# EAGLE design LACE_motherboard (EAGLE 5.09)
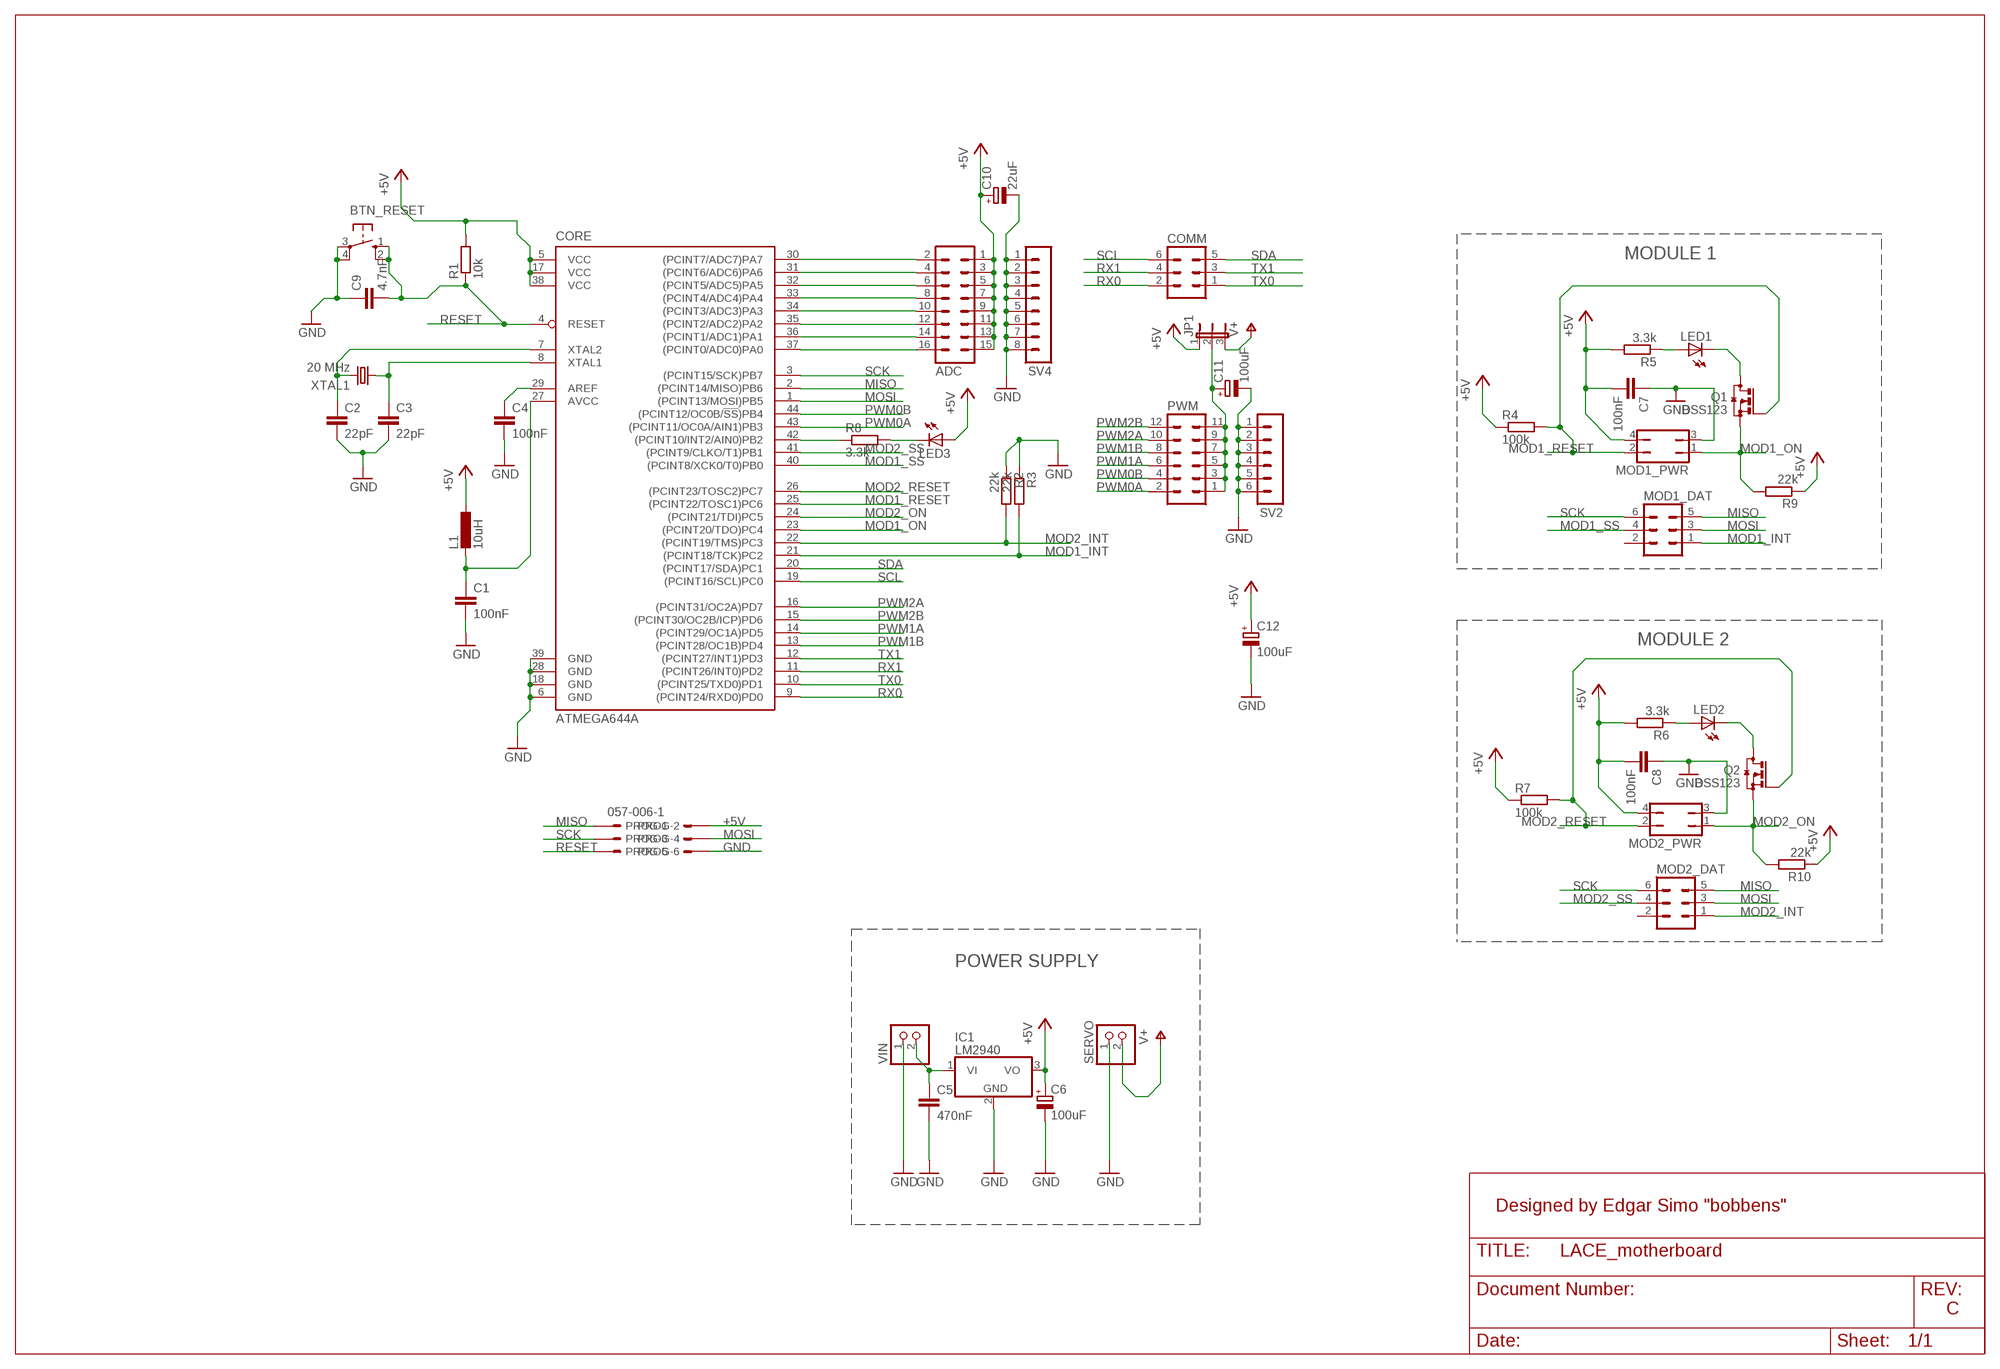
[diagram p0: schematic, sheet 1]

## Parts
ADC  MA08-2  [MA08-2]
BTN_RESET  10-XX  [B3F-10XX]
C1  100nF  C-EUC0805K  [C0805K]
C2  22pF  C-EUC0805K  [C0805K]
C3  22pF  C-EUC0805K  [C0805K]
C4  100nF  C-EUC0805K  [C0805K]
C5  470nF  C-EUC0805K  [C0805K]
C6  100uF  CPOL-EUE5-4  [E5-4]
C7  100nF  C-EUC0805K  [C0805K]
C8  100nF  C-EUC0805K  [C0805K]
C9  4.7nF  C-EUC0805K  [C0805K]
C10  22uF  CPOL-EUE5-4  [E5-4]
C11  100uF  CPOL-EUE5-4  [E5-4]
C12  100uF  CPOL-EUE5-4  [E5-4]
COMM  MA03-2  [MA03-2]
CORE  ATMEGA644A  [TQFP44]
IC1  LM2940  7815T  [TO220H]
JP1  JP2E  [JP2]
L1  10uH  L-EUL0805  [L0805]
LED1  LEDCHIPLED_0805  [CHIPLED_0805]
LED2  LEDCHIPLED_0805  [CHIPLED_0805]
LED3  LEDCHIPLED_0805  [CHIPLED_0805]
MOD1_DAT  MA03-2  [MA03-2]
MOD1_PWR  JP2Q  [JP2Q]
MOD2_DAT  MA03-2  [MA03-2]
MOD2_PWR  JP2Q  [JP2Q]
PROG  057-006-1  [057-006-1]
PWM  MA06-2  [MA06-2]
Q1  BSS123  [SOT23]
Q2  BSS123  [SOT23]
R1  10k  R-EU_M0805  [M0805]
R2  22k  R-EU_M0805  [M0805]
R3  22k  R-EU_M0805  [M0805]
R4  100k  R-EU_M0805  [M0805]
R5  3.3k  R-EU_M0805  [M0805]
R6  3.3k  R-EU_M0805  [M0805]
R7  100k  R-EU_M0805  [M0805]
R8  3.3k  R-EU_M0805  [M0805]
R9  22k  R-EU_M0805  [M0805]
R10  22k  R-EU_M0805  [M0805]
SERVO  PINHD-1X2  [1X02]
SV2  MA06-1  [MA06-1]
SV4  MA08-1  [MA08-1]
VIN  PINHD-1X2  [1X02]
XTAL1  20 MHz  CRYSTALHC49S  [HC49/S]

## Nets
+5V: ADC.1 ADC.3 ADC.5 ADC.7 ADC.9 ADC.11 ADC.13 ADC.15 C6.+ C7.2 C8.2 C10.+ C12.+ CORE.5(VCC) CORE.17(VCC) CORE.38(VCC) IC1.3(VO) JP1.1 L1.1 LED3.A MOD1_PWR.4 MOD2_PWR.4 PROG.2 R1.2 R4.1 R5.2 R6.2 R7.1 R9.1 R10.1
BAT+: C5.1 IC1.1(VI) VIN.2
GND: BTN_RESET.3(P) BTN_RESET.4(P1) C1.2 C2.2 C3.2 C4.2 C5.2 C6.- C7.1 C8.1 C9.1 C10.- C11.- C12.- CORE.6(GND) CORE.18(GND) CORE.28(GND) CORE.39(GND) IC1.2(GND) MOD1_PWR.3 MOD2_PWR.3 PROG.6 R2.1 R3.1 SERVO.1 SV2.1 SV2.2 SV2.3 SV2.4 SV2.5 SV2.6 SV4.1 SV4.2 SV4.3 SV4.4 SV4.5 SV4.6 SV4.7 SV4.8 VIN.1
MISO: CORE.2((PCINT14/MISO)PB6) MOD1_DAT.5 MOD2_DAT.5 PROG.1
MOD1_INT: CORE.21((PCINT18/TCK)PC2) MOD1_DAT.1 R3.2
MOD1_ON: CORE.23((PCINT20/TDO)PC4) MOD1_PWR.1 Q1.2(S) R9.2
MOD1_RESET: CORE.25((PCINT22/TOSC1)PC6) MOD1_PWR.2 Q1.1(G) R4.2
MOD1_SS: CORE.40((PCINT8/XCK0/T0)PB0) MOD1_DAT.4
MOD2_INT: CORE.22((PCINT19/TMS)PC3) MOD2_DAT.1 R2.2
MOD2_ON: CORE.24((PCINT21/TDI)PC5) MOD2_PWR.1 Q2.2(S) R10.2
MOD2_RESET: CORE.26((PCINT23/TOSC2)PC7) MOD2_PWR.2 Q2.1(G) R7.2
MOD2_SS: CORE.41((PCINT9/CLKO/T1)PB1) MOD2_DAT.4
MOSI: CORE.1((PCINT13/MOSI)PB5) MOD1_DAT.3 MOD2_DAT.3 PROG.4
N$1: CORE.42((PCINT10/INT2/AIN0)PB2) R8.1
N$2: C2.1 CORE.7(XTAL2) XTAL1.2
N$3: C11.+ JP1.2 PWM.1 PWM.3 PWM.5 PWM.7 PWM.9 PWM.11
N$4: C4.1 CORE.29(AREF)
N$5: ADC.16 CORE.37((PCINT0/ADC0)PA0)
N$6: ADC.14 CORE.36((PCINT1/ADC1)PA1)
N$7: ADC.12 CORE.35((PCINT2/ADC2)PA2)
N$8: ADC.10 CORE.34((PCINT3/ADC3)PA3)
N$9: ADC.8 CORE.33((PCINT4/ADC4)PA4)
N$10: ADC.6 CORE.32((PCINT5/ADC5)PA5)
N$11: ADC.4 CORE.31((PCINT6/ADC6)PA6)
N$12: ADC.2 CORE.30((PCINT7/ADC7)PA7)
N$13: LED2.C Q2.3(D)
N$14: LED3.C R8.2
N$15: C1.1 CORE.27(AVCC) L1.2
N$16: C3.1 CORE.8(XTAL1) XTAL1.1
N$17: LED1.C Q1.3(D)
PWM0A: CORE.43((PCINT11/OC0A/AIN1)PB3) PWM.2
PWM0B: CORE.44((PCINT12/OC0B/!SS!)PB4) PWM.4
PWM1A: CORE.14((PCINT29/OC1A)PD5) PWM.6
PWM1B: CORE.13((PCINT28/OC1B)PD4) PWM.8
PWM2A: CORE.16((PCINT31/OC2A)PD7) PWM.10
PWM2B: CORE.15((PCINT30/OC2B/ICP)PD6) PWM.12
R1: LED2.A R6.1
R5: LED1.A R5.1
RESET: BTN_RESET.1(S) BTN_RESET.2(S1) C9.2 CORE.4(RESET) PROG.5 R1.1
RX0: COMM.2 CORE.9((PCINT24/RXD0)PD0)
RX1: COMM.4 CORE.11((PCINT26/INT0)PD2)
SCK: CORE.3((PCINT15/SCK)PB7) MOD1_DAT.6 MOD2_DAT.6 PROG.3
SCL: COMM.6 CORE.19((PCINT16/SCL)PC0)
SDA: COMM.5 CORE.20((PCINT17/SDA)PC1)
TX0: COMM.1 CORE.10((PCINT25/TXD0)PD1)
TX1: COMM.3 CORE.12((PCINT27/INT1)PD3)
V+: JP1.3 SERVO.2
Unconnected: MOD1_DAT.2 MOD2_DAT.2

## Notes on the sheet
- MODULE 1
- MODULE 2
- POWER SUPPLY
- Designed by Edgar Simo "bobbens"
- C

## Library data of the parts
ADC = con-lstb:MA08-2: PIN HEADER
BTN_RESET = switch-omron:10-XX: OMRON SWITCH
C1-C5 C7-C9 = rcl:C-EU: CAPACITOR, European symbol
C6 C10-C12 = rcl:CPOL-EU: POLARIZED CAPACITOR, European symbol
COMM MOD1_DAT MOD2_DAT = con-lstb:MA03-2: PIN HEADER
CORE = atmel:ATMEGA644: 8-bit Microcontroller with 64K Bytes In-System Programmable Flash Source: http://www.atmel.com/dyn/resources/prod_documents/doc2593.pdf
IC1 = linear:78*: Positive VOLTAGE REGULATOR Source: http://cache.national.com/ds/LM/LM78L05.pdf http://www.fairchildsemi.com/ds/LM/LM7805.pdf
JP1 = jumper:JP2E: JUMPER
L1 = rcl:L-EU: INDUCTOR, European symbol
LED1-LED3 = led:LED: LED OSRAM: - CHIPLED LG R971, LG N971, LY N971, LG Q971, LY Q971, LO R971, LY R971 LH N974, LH R974 LS Q976, LO Q976, LY Q976 LO Q996 - Hyper CHIPLED LW Q18S LB Q993, LB Q99A, LB R99A - SideLED LS A670, LO A670, LY A670, LG A670, LP A670 LB A673, LV A673, LT A673, LW A673 LH A674 LY A675 LS A676, LA A676, LO A676, LY A676, LW A676 LS A679, LY A679, LG A679 - Hyper Micro SIDELED® LS Y876, LA Y876, LO Y876, LY Y876 LT Y87S - SmartLED LW L88C, LW L88S LB L89C, LB L89S, LG L890 LS L89K, LO L89K, LY L89K LS L896, LA L896, LO L896, LY L896 - TOPLED LS T670, LO T670, LY T670, LG T670, LP T670 LSG T670, LSP T670, LSY T670, LOP T670, LYG T670 LG T671, LOG T671, LSG T671 LB T673, LV T673, LT T673, LW T673 LH T674 LS T676, LA T676, LO T676, LY T676, LB T676, LH T676, LSB T676, LW T676 LB T67C, LV T67C, LT T67C, LS T67K, LO T67K, LY T67K, LW E67C LS E67B, LA E67B, LO E67B, LY E67B, LB E67C, LV E67C, LT E67C LW T67C LS T679, LY T679, LG T679 LS T770, LO T770, LY T770, LG T770, LP T770 LB T773, LV T773, LT T773, LW T773 LH T774 LS E675, LA E675, LY E675, LS T675 LS T776, LA T776, LO T776, LY T776, LB T776 LHGB T686 LT T68C, LB T68C - Hyper Mini TOPLED® LB M676 - Mini TOPLED Santana® LG M470 LS M47K, LO M47K, LY M47K Source: http://www.osram.convergy.de LUXEON: - LUMILED® LXK2-PW12-R00, LXK2-PW12-S00, LXK2-PW14-U00, LXK2-PW14-V00 LXK2-PM12-R00, LXK2-PM12-S00, LXK2-PM14-U00 LXK2-PE12-Q00, LXK2-PE12-R00, LXK2-PE12-S00, LXK2-PE14-T00, LXK2-PE14-U00 LXK2-PB12-K00, LXK2-PB12-L00, LXK2-PB12-M00, LXK2-PB14-N00, LXK2-PB14-P00, LXK2-PB14-Q00 LXK2-PR12-L00, LXK2-PR12-M00, LXK2-PR14-Q00, LXK2-PR14-R00 LXK2-PD12-Q00, LXK2-PD12-R00, LXK2-PD12-S00 LXK2-PH12-R00, LXK2-PH12-S00 LXK2-PL12-P00, LXK2-PL12-Q00, LXK2-PL12-R00 Source: www.luxeon.com KINGBRIGHT: KA-3528ASYC Source: www.kingbright.com
MOD1_PWR MOD2_PWR = jumper:JP2Q: JUMPER
PROG = con-panduit:057-006-: CONNECTOR 6-pin series 057 contact pc board low profile headers
PWM = con-lstb:MA06-2: PIN HEADER
Q1 Q2 = transistor-small-signal:BSS123: N-CHANNEL MOS FET
R1-R10 = rcl:R-EU_: RESISTOR, European symbol
SERVO VIN = pinhead:PINHD-1X2: PIN HEADER
SV2 = con-lstb:MA06-1: PIN HEADER
SV4 = con-lstb:MA08-1: PIN HEADER
XTAL1 = crystal:CRYSTAL: CRYSTAL

## Board
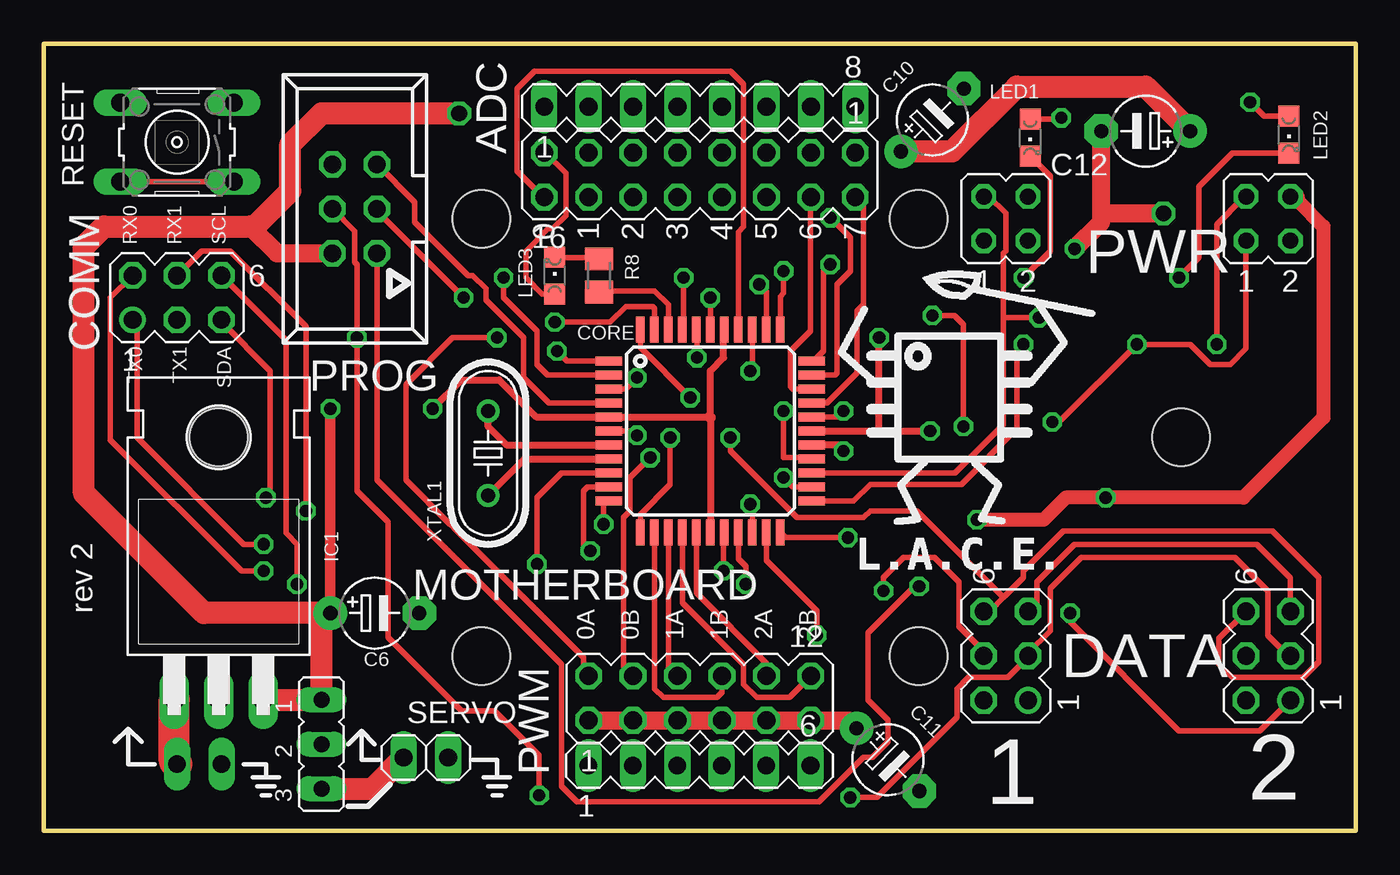
[diagram p1: board, top side]
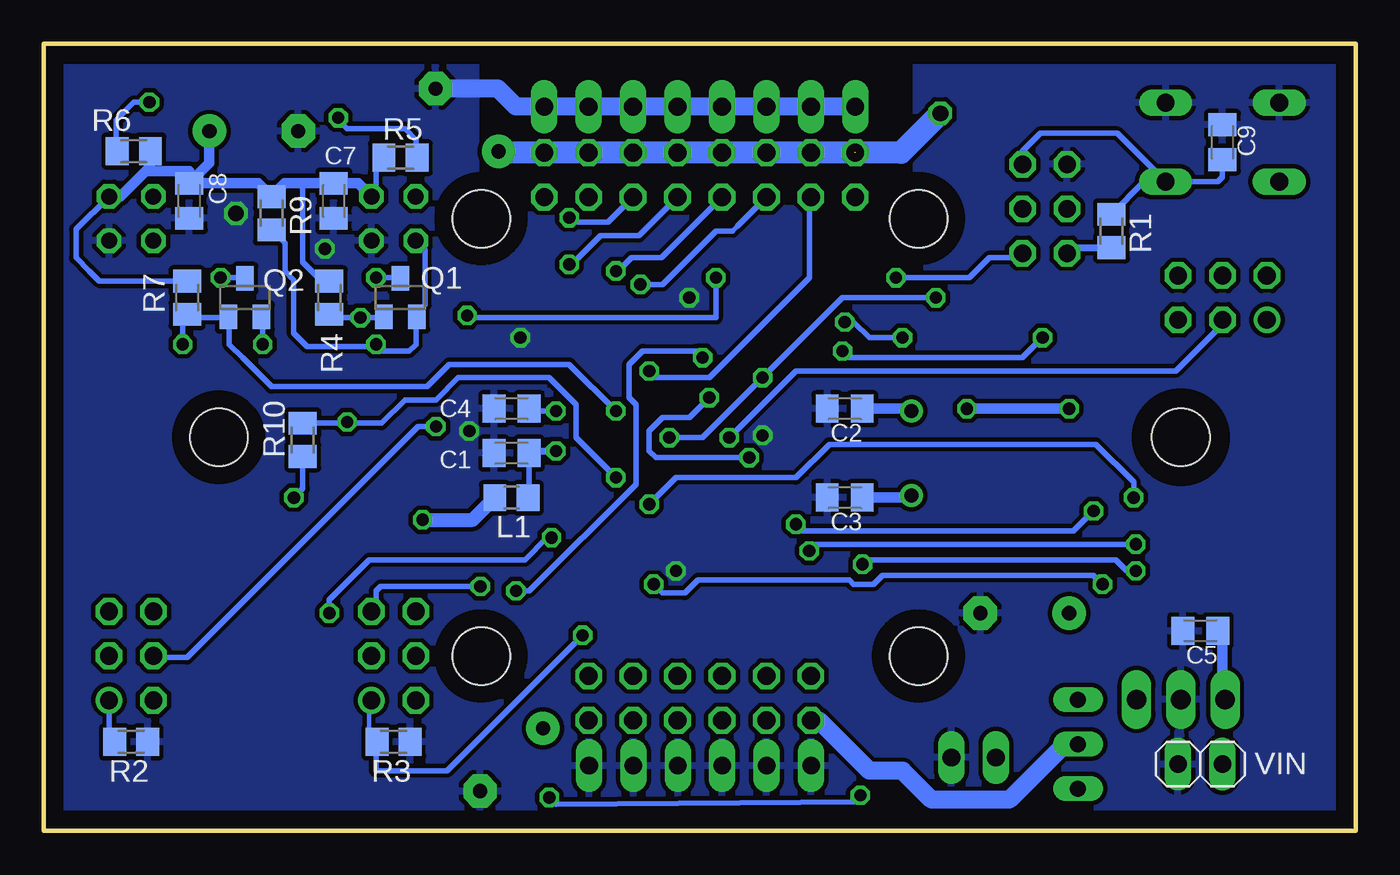
[diagram p2: board, bottom side, seen from below]

Size 75 x 45 mm. Coordinates in mm from the lower left corner, seen from the top.
Outline: 0,0 75,0 75,45 0,45 0,0
Copper layers (1*16): Top 0.035mm / dielectric 1.5mm / Bottom 0.035mm
Design rules "olimex-10mils *": minimum track width 10mil, minimum drill 0.7mm, track to track 10mil, track to pad 10mil, pad to pad 10mil, via to via 10mil, smd to smd 10mil, copper to edge 40mil, drill to drill 10mil, minimum pad ring 10mil, minimum via ring 8mil, stop-mask expansion 0mil, vias tented up to drill 0mil, thermal gap 10mil
Holes 3.3 mm at 25,35 50,35 50,10 25,10 65,22.5

### Footprints (pad centres in the part's own frame; a part is rotated, then mirrored left to right if it is on the bottom)
MA08-2 = drill 1.016 octagon: 1 -8.89,-1.27; 2 -8.89,1.27; 3 -6.35,-1.27; 4 -6.35,1.27; 5 -3.81,-1.27; 6 -3.81,1.27; 7 -1.27,-1.27; 8 -1.27,1.27; 9 1.27,-1.27; 10 1.27,1.27; 11 3.81,-1.27; 12 3.81,1.27; 13 6.35,-1.27; 14 6.35,1.27; 15 8.89,-1.27; 16 8.89,1.27
B3F-10XX = drill 1.016 long: 1 -3.251,2.261; 2 3.251,2.261; 3 -3.251,-2.261; 4 3.251,-2.261
C0805K = smd 1.3 x 1.6: 1 -1,0; 2 1,0
E5-4 = drill 0.813 pad 1.905 round: + -2.54,0 | drill 0.813 pad 1.905 octagon: - 2.54,0
MA03-2 = drill 1.016 round: 1 -2.54,-1.27 | drill 1.016 octagon: 2 -2.54,1.27; 3 0,-1.27; 4 0,1.27; 5 2.54,-1.27; 6 2.54,1.27
TQFP44 = smd 1.5 x 0.5: 1 -5.8,4; 2 -5.8,3.2; 3 -5.8,2.4; 4 -5.8,1.6; 5 -5.8,0.8; 6 -5.8,0; 7 -5.8,-0.8; 8 -5.8,-1.6; 9 -5.8,-2.4; 10 -5.8,-3.2; 11 -5.8,-4; 23 5.8,-4; 24 5.8,-3.2; 25 5.8,-2.4; 26 5.8,-1.6; 27 5.8,-0.8; 28 5.8,0; 29 5.8,0.8; 30 5.8,1.6; 31 5.8,2.4; 32 5.8,3.2; 33 5.8,4 | smd 0.5 x 1.5: 12 -4,-5.8; 13 -3.2,-5.8; 14 -2.4,-5.8; 15 -1.6,-5.8; 16 -0.8,-5.8; 17 0,-5.8; 18 0.8,-5.8; 19 1.6,-5.8; 20 2.4,-5.8; 21 3.2,-5.8; 22 4,-5.8; 34 4,5.8; 35 3.2,5.8; 36 2.4,5.8; 37 1.6,5.8; 38 0.8,5.8; 39 0,5.8; 40 -0.8,5.8; 41 -1.6,5.8; 42 -2.4,5.8; 43 -3.2,5.8; 44 -4,5.8
TO220H = drill 1.118 long: 1 -2.54,-10.16; 2 0,-10.16; 3 2.54,-10.16 | hole 3.302: 0,4.826
JP2 = drill 0.914 long: 1 -2.54,0; 2 0,0; 3 2.54,0
L0805 = smd 1.3 x 1.5: 1 -0.95,0; 2 0.95,0
CHIPLED_0805 = smd 1.2 x 1.2: A 0,-1.05; C 0,1.05
JP2Q = drill 0.914 octagon: 1 -1.27,-1.27; 2 -1.27,1.27; 3 1.27,-1.27; 4 1.27,1.27
057-006-1 = drill 1 octagon: 1 -2.54,-1.27; 2 -2.54,1.27; 3 0,-1.27; 4 0,1.27; 5 2.54,-1.27; 6 2.54,1.27
MA06-2 = drill 1.016 octagon: 1 -6.35,-1.27; 2 -6.35,1.27; 3 -3.81,-1.27; 4 -3.81,1.27; 5 -1.27,-1.27; 6 -1.27,1.27; 7 1.27,-1.27; 8 1.27,1.27; 9 3.81,-1.27; 10 3.81,1.27; 11 6.35,-1.27; 12 6.35,1.27
SOT23 = smd 1 x 1.4: 1 -0.95,-1.1; 2 0.95,-1.1; 3 0,1.1
M0805 = smd 1.3 x 1.6: 1 -0.95,0; 2 0.95,0
1X02 = drill 1.016 long: 1 -1.27,0; 2 1.27,0
MA06-1 = drill 1.016 long: 1 -6.35,0; 2 -3.81,0; 3 -1.27,0; 4 1.27,0; 5 3.81,0; 6 6.35,0
MA08-1 = drill 1.016 long: 1 -8.89,0; 2 -6.35,0; 3 -3.81,0; 4 -1.27,0; 5 1.27,0; 6 3.81,0; 7 6.35,0; 8 8.89,0
HC49/S = drill 0.813 round: 1 -2.413,0; 2 2.413,0

### Placement (x,y rotation side)
ADC  37.5,37.5 180 top
BTN_RESET  7.62,39.37 180 top
C1  48.26,21.59 180 bottom
C2  29.21,24.13 180 bottom
C3  29.21,19.05 180 bottom
C4  48.26,24.13 180 bottom
C5  8.89,11.43 180 bottom
C6  18.92,12.45 0 top
C7  58.42,36.02 90 bottom
C8  66.67,36.02 90 bottom
C9  7.62,39.37 270 bottom
C10  50.8,40.64 45 top
C11  48.26,4.06 315 top
C12  62.99,40.01 180 top
COMM  7.62,30.48 0 top
CORE  38.1,22.86 0 top
IC1  10,17.67 0 top
JP1  15.88,4.95 270 top
L1  48.26,19.05 0 bottom
LED1  56.39,39.62 180 top
LED2  71.18,39.8 180 top
LED3  29.21,31.75 0 top
MOD1_DAT  55,10 90 top
MOD1_PWR  55,35 0 top
MOD2_DAT  70,10 90 top
MOD2_PWR  70,35 0 top
PROG  17.78,35.56 90 top
PWM  37.5,7.58 0 top
Q1  54.61,30.48 0 bottom
Q2  63.5,30.48 0 bottom
R1  13.97,34.29 270 bottom
R2  70,5.08 180 bottom
R3  55,5.08 180 bottom
R4  58.67,30.48 270 bottom
R5  54.61,38.48 180 bottom
R6  69.85,38.86 0 bottom
R7  66.8,30.48 270 bottom
R8  31.75,31.75 90 top
R9  61.98,35.31 270 bottom
R10  60.2,22.35 90 bottom
SERVO  21.84,4.19 180 top
SV2  37.48,3.72 0 top
SV4  37.5,41.4 0 top
VIN  8.89,3.81 0 bottom
XTAL1  25.4,21.59 90 top

### Tracks (layer width: path | path; a pad name or v marks a point on that pad's centre or on a via)
+5V  (via drill 0.7, 0.9)  (1 unrouted)
  Top 0.254: 38.86,28.57 CORE.38
  Top 0.305: CORE.5 32,23.62 | 28.67,38.77 29.84,37.59 29.84,35.18 29.08,34.42 28.83,34.42 27.56,33.15 27.56,31.62 28.48,30.7 LED3.A
  Top 0.406: 38.86,28.57 38.86,27.05 38.1,26.29 38.1,23.62 CORE.17 | v22.23,24.13 23.88,25.78 26.04,25.78 28.16,23.66 CORE.5 38.06,23.66
  Top 0.61: C6.+ v16.38,24.13 | 38.06,23.66 38.1,23.62
  Top 0.813: MOD2_PWR.4 71.68,36.27 71.68,36.02 73.15,34.54 73.15,23.62 68.58,19.05 v60.71,19.05 58.42,19.05 57.15,17.78 v53.34,17.78
  Top 1.016: PROG.2 13.34,33.02 11.81,34.54
  Top 1.27: IC1.3 12.55,7.49 JP1.1 15.88,11.94 C6.+ 9.14,12.45 2.29,19.3 2.29,33.4 3.43,34.54 11.81,34.54 12.06,34.54 14.1,36.58 14.1,39.24 15.88,41.02 v23.75,41.02 | C12.+ 62.99,42.55 55.63,42.55 51.92,38.84 C10.+
  Bottom 0.254: L1.1 49.15,19.05 | 72.39,32 72.01,31.62
  Bottom 0.305: R5.2 56.01,38.1 56.01,36.58 MOD1_PWR.4 | R10.1 60.2,19.56 v60.71,19.05 | R4.1 59.12,31.43 60.2,32.51 60.2,36.76 60.45,37.02 | MOD2_PWR.4 73.15,34.39 73.15,32.77 72.39,32 71.82,31.43 R7.1
  Bottom 0.406: R1.2 16.19,33.34 PROG.2 | 49,38.77 C10.+
  Bottom 0.61: 56.39,36.2 MOD1_PWR.4 57.02,37.02 C7.2 60.45,37.02 61.22,37.02 R9.1 62.74,37.02 C8.2 | MOD2_PWR.4 70.63,36.27 69.18,37.72 | R6.2 68.9,38 69.18,37.72 | 69.18,37.72 66.67,37.72 C8.2 | C10.+ 48.93,38.77 | C12.+ 65.53,38.16 C8.2 | v16.38,24.13 v22.23,24.13
  Bottom 0.813: v53.34,17.78 50.48,17.78 L1.1
  Bottom 1.27: v23.75,41.02 26,38.77 ADC.15 ADC.13 ADC.11 ADC.9 ADC.7 ADC.5 ADC.3 ADC.1 49,38.77
BAT+
  Top 1.778: IC1.1 7.46,3.97 VIN.2
  Bottom 0.254: 7.62,11.43 C5.1 | IC1.1 7.62,7.62
  Bottom 0.61: 7.62,7.62 7.62,11.43
GND  (via drill 0.7, 0.9)
  Top 0.305: CORE.39 v38.1,30.48 | v38.86,14.86 38.86,16.76 CORE.18 | CORE.6 33.66,22.86 v33.91,22.61
  Top 0.406: CORE.28 47.75,22.86 | 47.75,22.86 v50.67,22.86 | 47.75,22.86 v47.75,28.19
  Top 1.016: 60.45,35.31 60.45,34.8 v58.93,33.27 | 60.45,35.31 C12.- | 60.45,35.31 v64.01,35.31
  Bottom 1.016: SV4.1 SV4.2 SV4.3 SV4.4 SV4.5 SV4.6 SV4.7 SV4.8 48.01,41.4 49.04,42.44 C10.-
  pour Bottom (isolate 0.254): 0,44.96 25.15,44.96 25.15,35.56 50.29,35.56 50.29,45.21 74.68,45.21 74.68,0 -0.51,0.25
MISO  (via drill 0.7)
  Top 0.305: MOD1_DAT.5 56.39,12.57 56.77,12.95 56.77,14.22 58.93,16.38 69.34,16.38 71.27,14.46 MOD2_DAT.5 | v26.29,31.62 26.29,30.48 28.19,28.57 28.19,26.67 28.8,26.06 CORE.2 | PROG.1 19.05,20.07 29.59,9.53 29.59,2.54 30.48,1.65 44.32,1.65 46.86,4.19 47.37,4.19 48.26,5.08 48.26,6.35 47.12,7.49 47.12,11.3 49.78,13.97 v50.04,13.97
  Bottom 0.254: PROG.1 19.05,32.77
  Bottom 0.305: v26.29,31.62 22.1,31.62 20.95,32.77 19.05,32.77 | MOD1_DAT.5 56.01,12.57 56.01,13.72 55.75,13.97 v50.04,13.97
MOD1_INT  (via drill 0.7)
  Top 0.305: v44.2,11.18 44.2,12.57 41.3,15.47 CORE.21
  Bottom 0.254: 56.01,4.95 R3.2 | 56.39,5.33 56.39,7.24 MOD1_DAT.1
  Bottom 0.305: 56.01,4.95 56.01,3.43 51.94,3.43 v44.2,11.18 | R3.2 56.39,5.33
MOD1_ON  (via drill 0.7)
  Top 0.305: v56.01,27.81 55.63,27.43 55.63,22.99 52.45,19.81 47.24,19.81 46.29,18.86 CORE.23
  Bottom 0.254: 53.72,29.34 Q1.2
  Bottom 0.305: 53.72,29.34 53.72,27.81 54.1,27.43 55.63,27.43 v56.01,27.81 56.13,27.69 59.94,27.69 60.71,28.45 60.71,31.5 61.21,32 61.21,33.59 R9.2 | Q1.2 53.66,29.65 53.21,30.1 53.21,33.21 MOD1_PWR.1
MOD1_RESET  (via drill 0.7)
  Top 0.305: 54.86,29.34 v56.9,29.34 | MOD1_PWR.2 54.03,36.27 54.99,35.31 54.99,33.15 54.86,33.02 54.86,29.34 | CORE.25 52.08,20.46 54.86,23.24 54.86,29.34
  Bottom 0.254: 55.63,29.34 Q1.1 | 58.29,29.34 R4.2
  Bottom 0.305: 58.29,29.34 v56.9,29.34 55.63,29.34
MOD1_SS  (via drill 0.7)
  Top 0.254: 37.34,28.57 CORE.40
  Top 0.305: v37.34,27.05 37.34,28.57 | MOD1_DAT.4 53.72,10.29 52.32,11.68 52.32,14.22 50.93,15.62 49.15,15.62 48.01,14.48 v48.01,13.72
  Bottom 0.305: v37.34,27.05 37.72,27.43 40.77,27.43 41.53,26.67 41.53,24.77 41.15,24.38 41.15,19.81 47.24,13.72 v48.01,13.72
MOD2_INT  (via drill 0.7)
  Top 0.305: v45.97,16.76 42.4,16.76 CORE.22 | v58.67,12.45 58.67,11.94 64.9,5.71 69.53,5.71 MOD2_DAT.1
  Bottom 0.254: 71.25,5.33 R2.2 | v58.67,12.45 58.67,12.7
  Bottom 0.305: 71.25,5.33 71.25,7.24 MOD2_DAT.1 | v45.97,16.76 46.23,16.76 47.5,15.49 56.39,15.49 58.67,13.21 v58.67,12.45
MOD2_ON  (via drill 0.7)
  Top 0.254: v62.48,27.81 62.42,27.81 | 68.71,33.71 MOD2_PWR.1
  Top 0.305: CORE.24 42.82,19.66 v42.29,20.19 | v57.66,23.37 58.04,23.37 v62.48,27.81 65.53,27.81 66.67,26.67 67.82,26.67 68.71,27.56 68.71,33.71
  Bottom 0.254: 62.48,29.21 62.48,29.34 | 57.59,23.3 v57.66,23.37
  Bottom 0.305: v62.48,27.81 62.48,29.21 | v42.29,20.19 44.58,22.48 44.58,24.38 45.72,25.53 46.1,25.91 51.31,25.91 52.58,24.64 54.36,24.64 55.69,23.3 57.59,23.3 | R10.2 57.72,23.3 v57.66,23.37
  Bottom 0.61: Q2.2 62.55,29.28 62.48,29.21
MOD2_RESET  (via drill 0.7)
  Top 0.305: v42.29,24 42.29,21.34 43.81,21.34 CORE.26 | v67.06,27.81 67.06,34.67 68.58,36.2 MOD2_PWR.2
  Bottom 0.254: 64.77,29.34 Q2.1 64.39,29.34 | 63.63,27.05 63.25,26.67
  Bottom 0.305: 64.77,29.34 66.67,29.34 R7.2 67.06,29.34 v67.06,27.81 | v42.29,24 44.96,26.67 51.82,26.67 53.09,25.4 61.98,25.4 63.63,27.05 64.39,27.81 64.39,29.34
MOD2_SS  (via drill 0.7)
  Top 0.305: v36.58,31.62 36.58,28.96 CORE.41 | v52.58,23.11 52.58,28.96 52.07,29.46 v50.8,29.46
  Bottom 0.305: v36.58,31.62 36.58,29.34 48.01,29.34 50.67,29.34 v50.8,29.46 | MOD2_DAT.4 68.58,9.91 66.8,9.91 53.59,23.11 v52.58,23.11
MOSI  (via drill 0.7)
  Top 0.305: v46.1,1.91 47.62,1.91 52.2,6.48 52.2,8.13 52.83,8.76 55.12,8.76 56.27,9.91 MOD1_DAT.3 56.27,10.17 57.53,11.43 57.53,13.84 59.31,15.62 68.07,15.62 69.98,13.72 69.98,11.18 71.15,10 MOD2_DAT.3 | PROG.4 17.78,34.29 17.78,32.51 17.91,32.38 v17.91,28.19 17.91,19.43 19.68,17.65 19.68,11.05 23.88,6.86 25.78,6.86 28.32,4.32 v28.32,2.03 | CORE.1 29.91,26.86 v29.34,27.43
  Bottom 0.305: v29.34,27.43 28.96,27.05 19.05,27.05 v17.91,28.19 | v28.32,2.03 28.19,1.65 45.72,1.52 v46.1,1.91
N$1
  Top 0.305: CORE.42 35.7,30.09 34.92,30.86 31.81,30.86 R8.1
N$2
  Top 0.406: CORE.7 26.45,22.06 25.4,23.11 XTAL1.2
  Bottom 0.406: XTAL1.2 25.53,24.13
  Bottom 0.61: 25.53,24.13 C2.1
N$3
  Top 1.016: PWM.1 PWM.3 PWM.5 PWM.7 PWM.9 PWM.11 46.01,6.31 C11.+
  Bottom 0.813: 30.69,6.31 PWM.1 | JP1.2 16.64,4.95
  Bottom 1.016: 30.69,6.31 27.81,3.43 25.91,3.43 24.26,1.78 19.81,1.78 16.64,4.95
N$4  (via drill 0.7)
  Top 0.305: CORE.29 45.38,23.66 v45.72,24
  Bottom 0.254: 47.24,24 C4.1
  Bottom 0.305: v45.72,24 47.24,24
N$5
  Top 0.305: ADC.16 28.54,36.23 27.05,37.72 27.05,42.42 28.07,43.43 39.24,43.43 40.01,42.67 40.01,34.54 39.7,34.24 CORE.37
N$6  (via drill 0.7)
  Top 0.305: CORE.36 40.5,26.4 v40.39,26.29
  Bottom 0.305: v40.39,26.29 40.01,25.91 36.96,25.91 31.24,31.62 31.24,36.2 ADC.14
N$7  (via drill 0.7)
  Top 0.305: CORE.35 41.3,30.84 v40.89,31.24
  Bottom 0.254: 35.34,34.58 35.63,34.29
  Bottom 0.305: 35.34,34.58 ADC.12 | v40.89,31.24 39.62,31.24 36.58,34.29 35.63,34.29
N$8  (via drill 0.7)
  Top 0.305: CORE.34 42.1,30.54 42.29,30.73 v42.29,32
  Bottom 0.254: v42.29,32 42.16,32
  Bottom 0.305: 42.16,32 41.4,32.77 39.69,32.77 ADC.10
N$9  (via drill 0.7)
  Top 0.305: v44.96,32.38 44.58,32 44.58,27.43 44.2,27.05 CORE.33
  Bottom 0.305: v44.96,32.38 44.83,32.38 43.18,34.04 40.96,34.04 ADC.8
N$10  (via drill 0.7)
  Top 0.305: v44.96,35.05 46.1,33.91 46.1,32 45.34,31.24 45.34,26.16 45.24,26.06 CORE.32
  Bottom 0.305: v44.96,35.05 44.7,34.8 42.74,34.8 ADC.6
N$11
  Top 0.254: 43.81,36.2 ADC.4
  Top 0.305: 43.81,36.2 43.81,28.57 42.67,27.43 42.67,25.4 42.81,25.26 CORE.31
N$12
  Top 0.305: ADC.2 46.48,36.2 46.86,35.81 46.86,30.1 46.48,29.72 46.48,26.16 44.78,24.46 CORE.30
N$13  (via drill 0.7)
  Top 0.305: v64.9,31.62 66.04,32.77 66.04,36.83 67.96,38.74 LED2.C
  Bottom 0.254: Q2.3 63.63,31.62
  Bottom 0.305: 63.63,31.62 v64.9,31.62
N$14
  Top 0.305: LED3.C 29.34,32.77 31.62,32.77 R8.2
N$15  (via drill 0.7)
  Top 0.406: CORE.27 45.38,22.06 v45.72,21.72
  Bottom 0.254: L1.2 47.24,19.05 | C1.1 47.24,21.72
  Bottom 0.305: 47.24,19.05 47.24,21.34 C1.1
  Bottom 0.406: 47.24,21.72 v45.72,21.72
N$16
  Top 0.406: CORE.8 27.48,21.26 XTAL1.1
  Bottom 0.406: XTAL1.1 25.53,19.05
  Bottom 0.61: 25.53,19.05 C3.1
N$17  (via drill 0.7)
  Top 0.305: v56.01,31.62 57.53,33.15 57.53,37.43 LED1.C
  Bottom 0.305: v56.01,31.62 54.86,31.62 Q1.3
PWM0A  (via drill 0.7)
  Top 0.305: PWM.2 30.86,9.14 30.86,9.91 23.43,17.34 23.24,17.53 20.7,20.07 20.7,25.53 23.37,28.19 v25.91,28.19 | CORE.43 34.9,29.87 34.8,29.97 33.27,29.97 32.38,29.08 v29.21,29.08
  Bottom 0.305: v25.91,28.19 27.81,28.19 28.7,29.08 v29.21,29.08
PWM0B  (via drill 0.7)
  Top 0.305: v34.67,21.34 33.53,20.19 33.53,18.29 33.15,17.91 33.15,9.39 PWM.4 | CORE.44 34.1,27.62 v36.96,24.77
  Bottom 0.305: v36.96,24.77 38.1,23.62 39.62,23.62 40.39,22.86 40.39,21.72 40.01,21.34 v34.67,21.34
PWM1A
  Top 0.305: CORE.14 35.7,9.38 PWM.6
PWM1B
  Top 0.305: PWM.8 38.77,7.91 38.48,7.62 35.43,7.62 34.92,8.13 34.92,17.04 CORE.13
PWM2A
  Top 0.305: CORE.16 37.3,13.59 41.31,9.58 PWM.10
PWM2B
  Top 0.305: CORE.15 36.5,13.03 40.01,9.53 40.01,8.38 40.77,7.62 42.62,7.62 PWM.12
R1  (via drill 0.7)
  Top 0.305: LED2.A 69.77,40.85 v68.96,41.66
  Bottom 0.305: v68.96,41.66 69.85,41.66 70.87,40.64 70.87,38.93 R6.1
R5  (via drill 0.7)
  Top 0.305: LED1.A 58.07,40.67 v58.17,40.77
  Bottom 0.305: v58.17,40.77 58.17,40.64 57.66,40.13 54.36,40.13 53.72,39.5 53.72,38.54 R5.1
RESET
  Top 0.305: CORE.4 28.88,24.46 27.43,25.91 27.43,28.19 25.27,30.35 25.27,30.99 24.51,31.75 24.26,31.75 21.21,34.8 21.21,35.94 PROG.5 | BTN_RESET.2 BTN_RESET.1
  Bottom 0.305: BTN_RESET.1 12.1,37.11 R1.1 | C9.2 7.62,37.36 7.87,37.11 BTN_RESET.1 | PROG.5 19.05,38.86 18.03,39.88 13.64,39.88 BTN_RESET.1
RX0  (via drill 0.7)
  Top 0.305: v28.19,15.24 28.19,19.05 29.6,20.46 CORE.9 | COMM.2 3.81,30.48 3.81,22.35 11.3,14.86 v12.57,14.86
  Bottom 0.305: v12.57,14.86 13.08,14.86 13.72,15.49 27.94,15.49 v28.19,15.24
RX1  (via drill 0.7)
  Top 0.305: v32,17.53 32,18.67 CORE.11 | COMM.4 9.02,33.15 10.67,33.15 14.99,28.83 v14.99,18.29
  Bottom 0.305: v32,17.53 31.62,17.14 16.13,17.14 v14.99,18.29
SCK  (via drill 0.7)
  Top 0.305: 54.86,13.34 56.01,14.48 56.01,14.86 58.29,17.14 70.23,17.14 72.9,14.48 72.9,9.65 72.01,8.76 67.94,8.76 67.18,9.53 67.18,10.99 MOD2_DAT.6 | 54.86,13.34 54.1,12.57 MOD1_DAT.6 | v24,30.48 19.05,35.43 PROG.3 | 54.86,13.34 49.91,18.29 47.24,18.29 46.86,17.91 43.05,17.91 39.24,21.72 v39.24,22.48 | CORE.3 33.26,25.26 v33.91,25.91
  Bottom 0.305: v24,30.48 29.34,30.48 v33.91,25.91 37.34,22.48 v39.24,22.48
SCL  (via drill 0.7)
  Top 0.305: CORE.19 39.7,15.54 40.13,15.11 v40.13,14.1 | v14.48,14.1 14.48,16.38 13.84,17.02 13.84,28.07 COMM.6
  Bottom 0.305: v14.48,14.1 14.99,14.61 27.05,14.61 27.56,14.1 28.7,14.1 28.96,14.35 37.59,14.35 38.35,13.59 39.62,13.59 v40.13,14.1
SDA  (via drill 0.7)
  Top 0.305: v12.7,19.05 12.95,19.3 12.95,26.29 10.16,29.08 COMM.5 | CORE.20 40.5,18.55 v40.39,18.67
  Bottom 0.305: v40.39,18.67 38.86,20.19 32,20.19 30.1,22.1 14.86,22.1 12.7,19.94 v12.7,19.05
TX0  (via drill 0.7)
  Top 0.305: v31.24,16 30.86,16.38 30.86,19.43 31.09,19.66 CORE.10 | v12.57,16.38 11.43,16.38 5.33,22.48 5.33,28.96 COMM.1
  Bottom 0.305: v31.24,16 30.86,16.38 v12.57,16.38
TX1  (via drill 0.7)
  Top 0.305: v35.81,22.48 35.81,19.81 34.1,18.1 CORE.12
  Bottom 0.305: v35.81,22.48 32,26.29 10.29,26.29 8.76,27.81 8,28.57 7.62,28.96 COMM.3
V+
  Top 1.27: JP1.3 18.8,2.41 SERVO.2

### Text on the board
tNames: RESET | RX0 | RX1 | SCL | 0 | 1 | 2 | 3 | 4 | 5 | 6 | 7 | PWR | TX0 | TX1 | SDA | MOTHERBOARD | rev 2 | 0A | 0B | 1A | 1B | 2A | 2B | DATA | 1 | 2